# EAGLE design powerstrip (EAGLE 7.7.0)
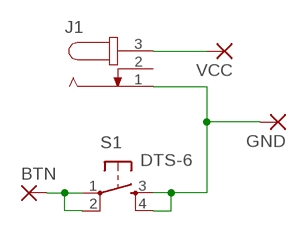
[diagram p0: schematic, sheet 1]

## Parts
BTN  WIREPADSMD2,54-5,08  [SMD2,54-5,08]
GND  WIREPADSMD2,54-5,08  [SMD2,54-5,08]
J1  PC-GK210  [PC-GK21]
S1  DTS-6  [DTS-6]
VCC  WIREPADSMD2,54-5,08  [SMD2,54-5,08]

## Nets
N$1: J1.3 VCC.1(P)
N$2: BTN.1(P) S1.1 S1.2
N$3: GND.1(P) J1.1 S1.3 S1.4
Unconnected: J1.2

## Library data of the parts
BTN GND VCC = wirepad:WIREPAD: Wire PAD connect wire on PCB
J1 = thecave:PC-GK21: DC power jack PC-GK2.1 https://www.gme.cz/napajeci-souosy-konektor-pc-gk2-1
S1 = switch-tact:DTS-6

## Board
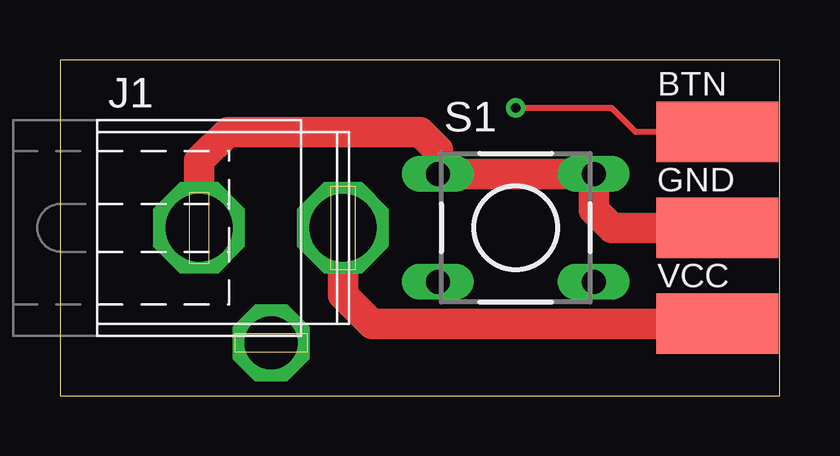
[diagram p1: board, top side]
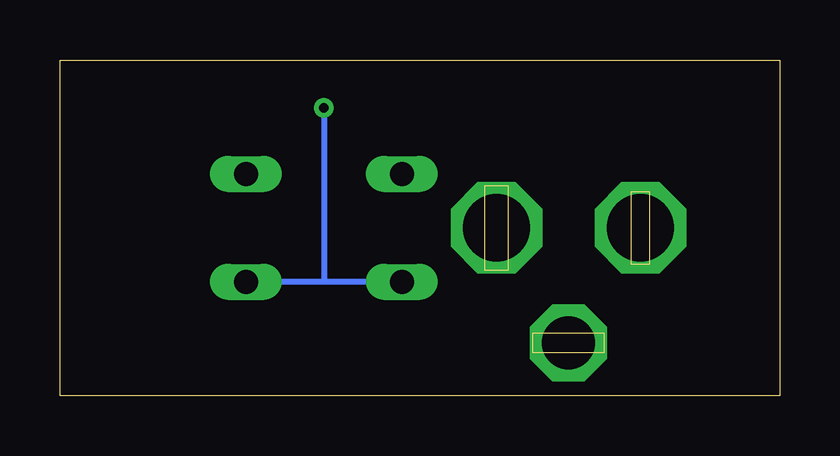
[diagram p2: board, bottom side, seen from below]

Size 30 x 14 mm. Coordinates in mm from the lower left corner, seen from the top.
Outline: 0,0 30,0 30,14 0,14 0,0
Copper layers (1*16): Top 0.035mm / dielectric 1.5mm / Bottom 0.035mm
Design rules "default *": minimum track width 10mil, minimum drill 24mil, track to track 10mil, track to pad 10mil, pad to pad 10mil, via to via 10mil, smd to smd 10mil, copper to edge 24mil, drill to drill 16mil, minimum pad ring 10mil, minimum via ring 8mil, stop-mask expansion 4mil, vias tented up to drill 0.4mm, thermal gap 10mil

### Footprints (pad centres in the part's own frame; a part is rotated, then mirrored left to right if it is on the bottom)
SMD2,54-5,08 = smd 2.54 x 5.08: 1 0,0
PC-GK21 = drill 2.8 octagon: 1 -3,0; 3 3,0 | drill 2.2 octagon: 2 0,-4.8
DTS-6 = drill 1 long: 1 -3.25,2.25; 2 3.25,2.25; 3 -3.25,-2.25; 4 3.25,-2.25

### Placement (x,y rotation side)
BTN  27.4,11 270 top
GND  27.4,7 270 top
J1  8.8,7 0 top
S1  19,7 180 top
VCC  27.4,3 270 top

### Tracks (layer width: path | path; a pad name or v marks a point on that pad's centre or on a via)
N$1
  Top 1.27: J1.3 11.8,4.2 13,3 VCC.1
N$2  (via drill 0.4)
  Top 0.254: BTN.1 24,11 23,12 v19,12
  Bottom 0.254: S1.2 19,4.75 | 19,4.75 S1.1 | v19,12 19,4.75
N$3
  Top 1.27: GND.1 23,7 22.25,7.75 S1.3 S1.4 15.75,10.25 15,11 7,11 5.8,9.8 J1.1